# EasyEDA Pro project ProPrj_信达杯电感_2025-12-12.epro

# Schematic Schematic1
Board Name: Board1; Create Date: 2025-11-11; Page Name: P1; Project Name: 信达杯电感; Schematic Name: Schematic1; Update Date: 2025-11-13; Company: 嘉立创EDA; Page Size: A4; Version: V1.0
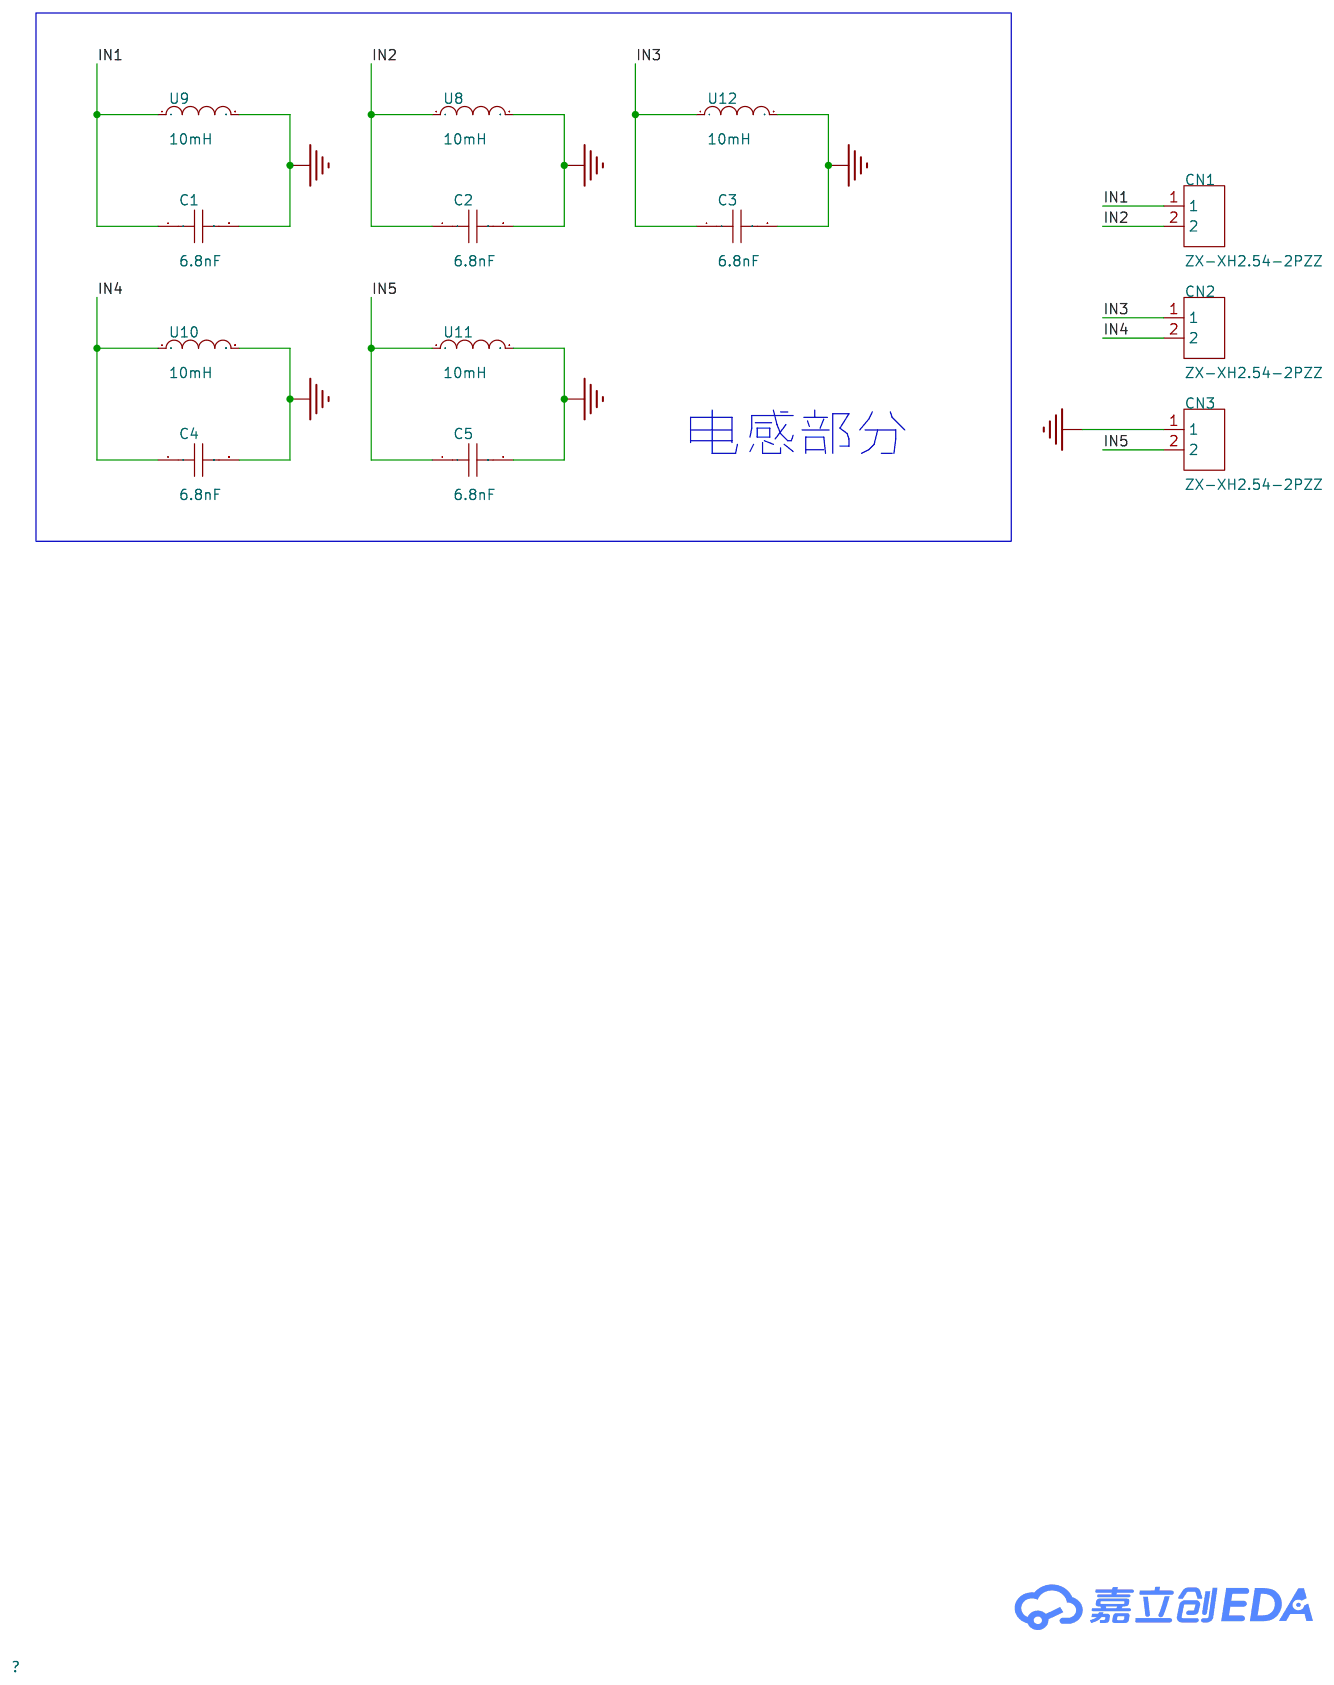
[diagram p0: schematic sheet]

## Parts
C1  6.8nF  [CAP-TH_L7.2-W2.5-P5.00-D0.5]
C2  6.8nF  [CAP-TH_L7.2-W2.5-P5.00-D0.5]
C3  6.8nF  [CAP-TH_L7.2-W2.5-P5.00-D0.5]
C4  6.8nF  [CAP-TH_L7.2-W2.5-P5.00-D0.5]
C5  6.8nF  [CAP-TH_L7.2-W2.5-P5.00-D0.5]
CN1  ZX-XH2.54-2PZZ  [CONN-TH_2P-P2.50_HX25003-2A]
CN2  ZX-XH2.54-2PZZ  [CONN-TH_2P-P2.50_HX25003-2A]
CN3  ZX-XH2.54-2PZZ  [CONN-TH_2P-P2.50_HX25003-2A]
U8  10mH  [IND-TH_BD7.5-P3.00-D0.6]
U9  10mH  [IND-TH_BD7.5-P3.00-D0.6]
U10  10mH  [IND-TH_BD7.5-P3.00-D0.6]
U11  10mH  [IND-TH_BD7.5-P3.00-D0.6]
U12  10mH  [IND-TH_BD7.5-P3.00-D0.6]

## Library data of the parts
C1-C5 = PE104J2A0501: 容值:100nF;精度:±5%;额定电压:100V;介电材料:金属化聚酯;工作温度:-40℃~+85℃;; LCSC Part Name: 100nF ±5% 100V; Supplier Part: C390170; Manufacturer: KYET(科雅); Supplier Footprint: 插件,P=5mm; JLCPCB Part Class: 扩展库; Datasheet: https://item.szlcsc.com/datasheet/PE104J2A0501/366203.html; Supplier: LCSC; Tolerance: ±5%; Voltage Rating: 100V; Dielectric Material: 金属化聚酯; Operating Temperature: -40℃~+85℃
CN1-CN3 = ZX-XH2.54-2PZZ: 插针结构:1x2P;间距:2.54mm;安装方式:直插;参考系列:XH;总PIN数:2P;排数:1;每排PIN数:2;行距:-;额定电流:3A;触头材质:黄铜;触头镀层:锡;工作温度范围:-25℃~+85℃;; Supplier Part: C7429632; Manufacturer: Megastar(兆星); Supplier Footprint: 插件,P=2.54mm; JLCPCB Part Class: 扩展库; Datasheet: https://atta.szlcsc.com/upload/public/pdf/source/20230619/19BA6947230AA44A04D3EDD65E618FD0.pdf; Supplier: LCSC; Pins Structure: 1x2P; Pitch: 2.54mm; Mounting Style: 直插; Reference Series: XH; Number of Pins: 2P; Number of Rows: 1; Number of PINs Per Row: 2; Current Rating (Max): 3A; Contact Material: 黄铜; Contact Plating: 锡; Operating Temperature Range: -25℃~+85℃
U8-U12 = XR6*8-122K-L: 电感值:1.2mH;精度:±10%;类型:工字电感;; Supplier Part: C5380231; Manufacturer: XR(祥如); Supplier Footprint: 插件,D6xL8mm; JLCPCB Part Class: 扩展库; Datasheet: https://atta.szlcsc.com/upload/public/pdf/source/20230605/8CE12735EDCB91383FD21B41176BD527.pdf; Supplier: LCSC; Tolerance: ±10%; Type: 工字电感

## Nets
GND: C1.2 C2.2 C3.2 C4.2 C5.2 CN3.1 U8.2 U9.2 U10.2 U11.2 U12.2
IN1: C1.1 CN1.1 U9.1
IN2: C2.1 CN1.2 U8.1
IN3: C3.1 CN2.1 U12.1
IN4: C4.1 CN2.2 U10.1
IN5: C5.1 CN3.2 U11.1

## Notes on the sheet
- 电感部分

# Schematic Schematic2
Board Name: Board2; Create Date: 2025-11-11; Page Name: P1; Project Name: 信达杯电感; Schematic Name: Schematic2; Update Date: 2025-11-13; Company: 嘉立创EDA; Page Size: A4; Version: V1.0
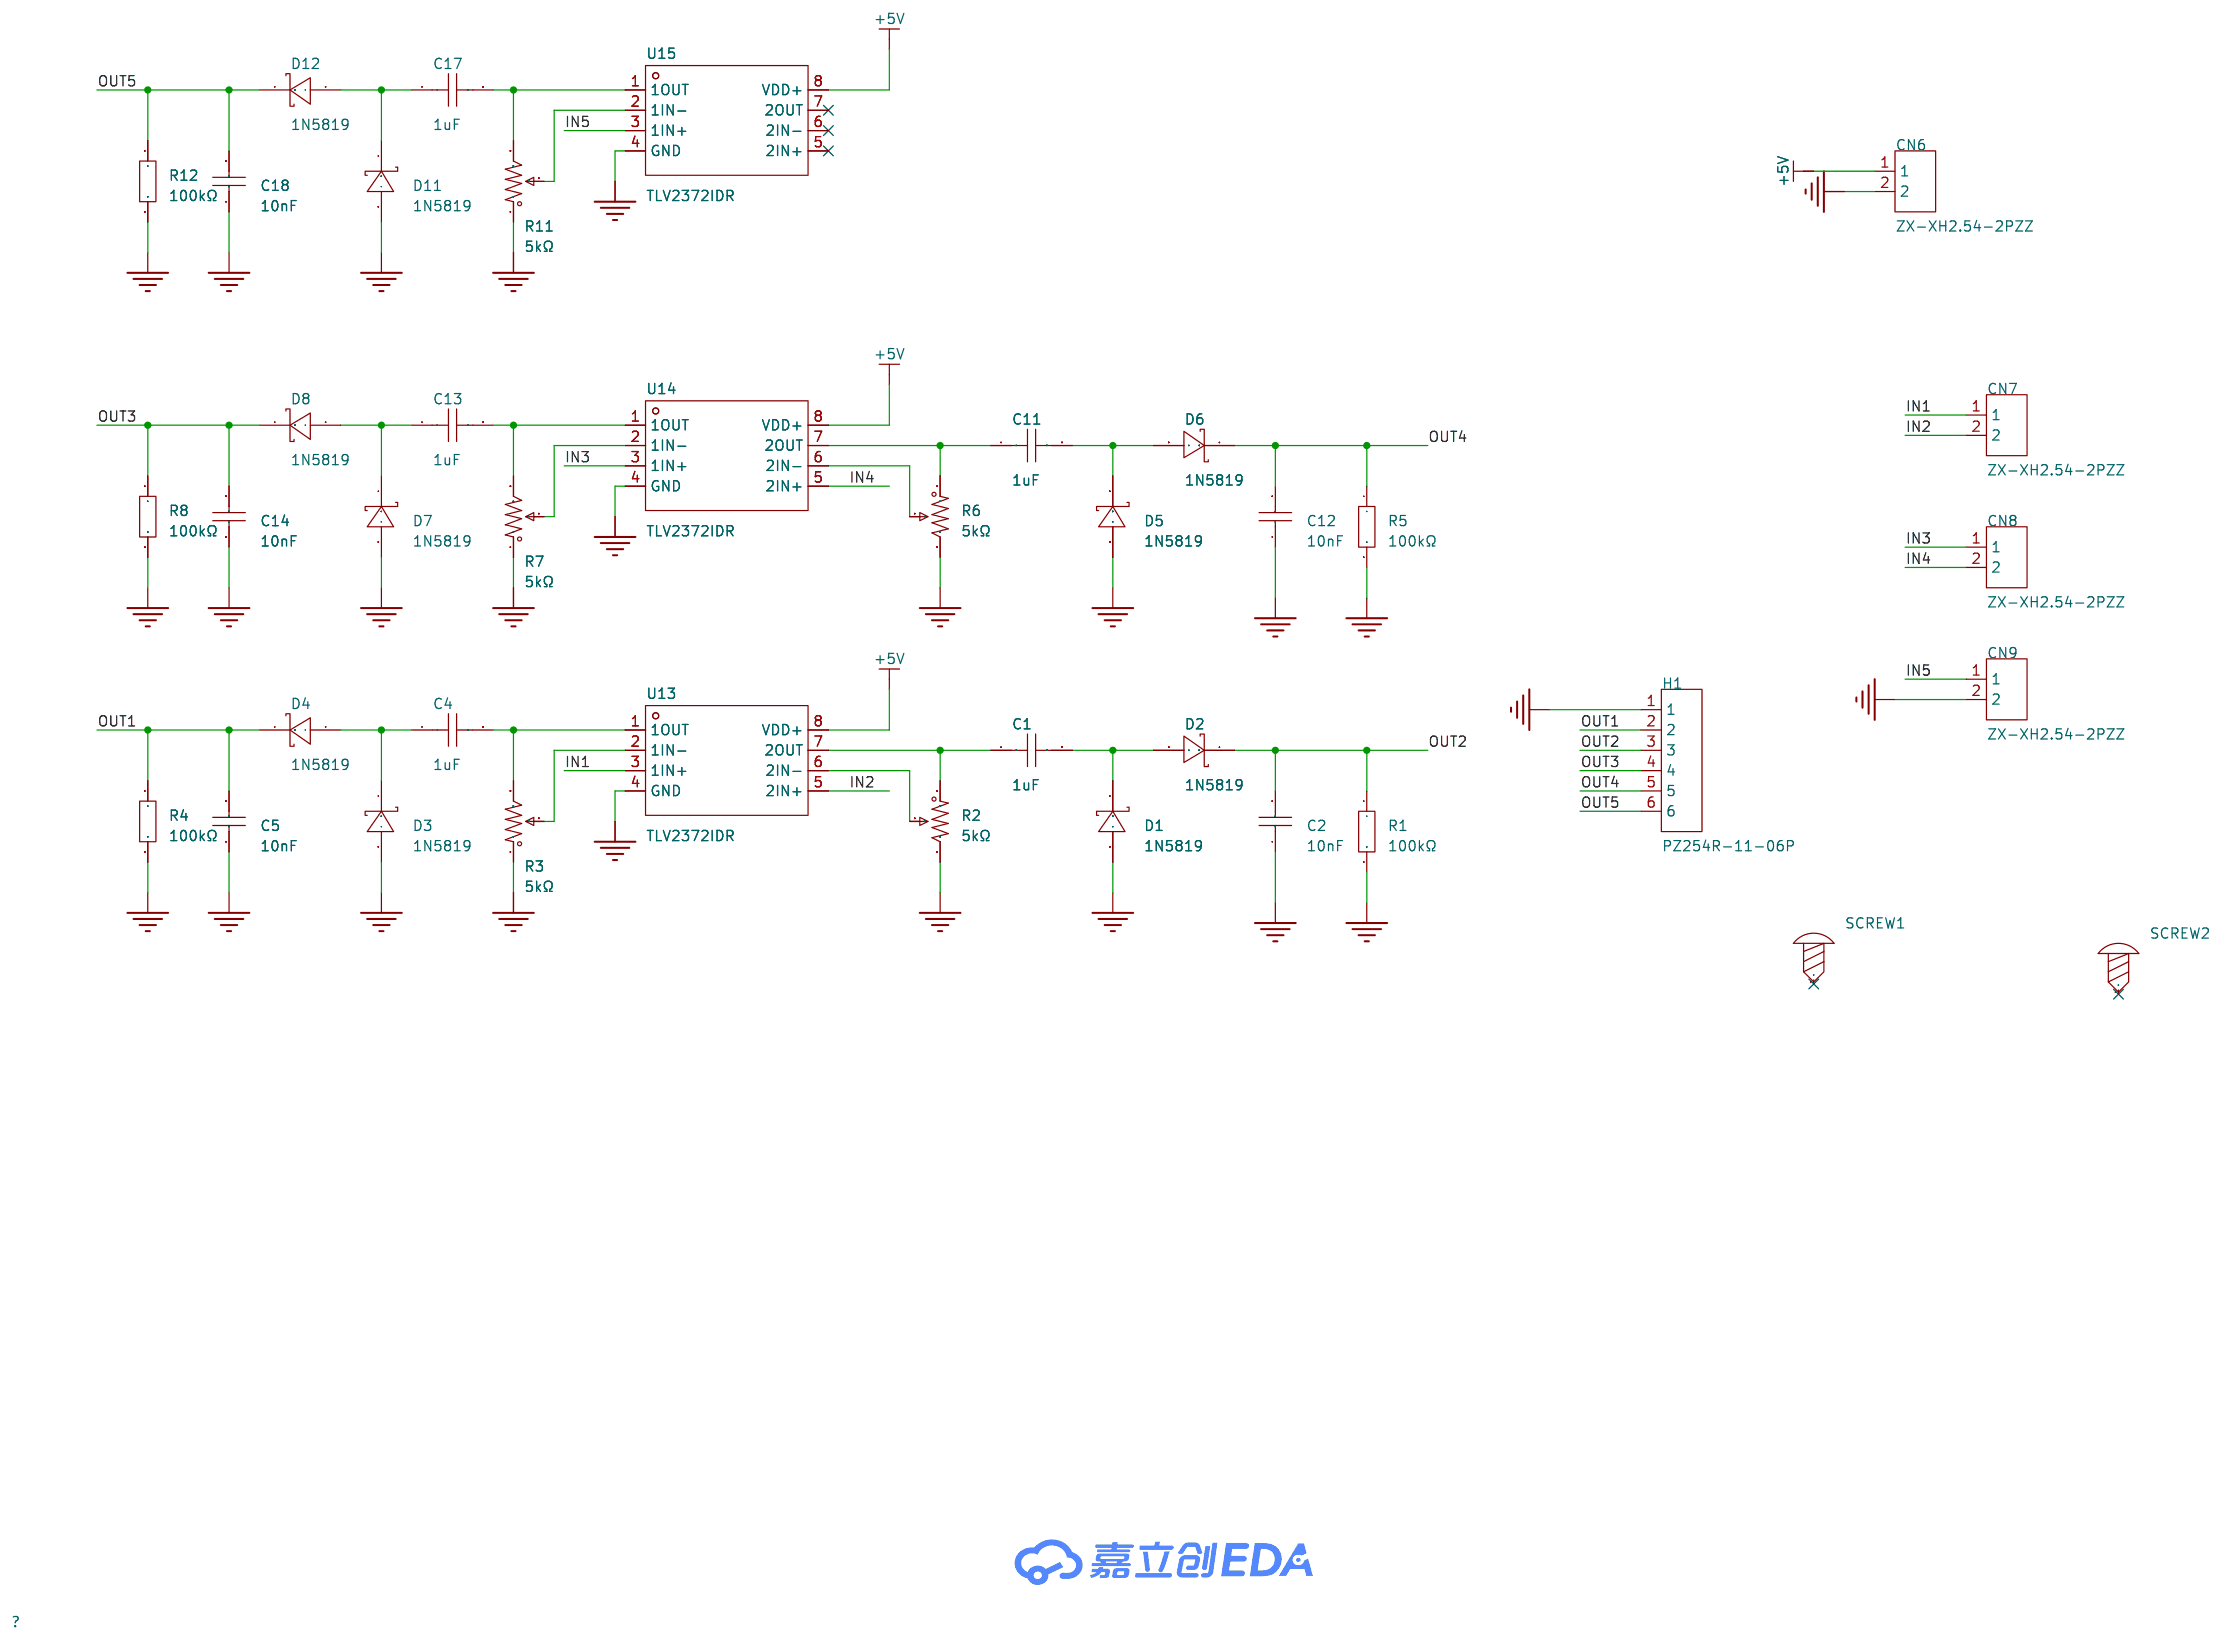
[diagram p1: schematic sheet]

## Parts
C1  1uF  [C0603]
C2  10nF  [C0603]
C4  1uF  [C0603]
C5  10nF  [C0603]
C11  1uF  [C0603]
C12  10nF  [C0603]
C13  1uF  [C0603]
C14  10nF  [C0603]
C17  1uF  [C0603]
C18  10nF  [C0603]
CN6  ZX-XH2.54-2PZZ  [CONN-TH_2P-P2.50_HX25003-2A]
CN7  ZX-XH2.54-2PZZ  [CONN-TH_2P-P2.50_HX25003-2A]
CN8  ZX-XH2.54-2PZZ  [CONN-TH_2P-P2.50_HX25003-2A]
CN9  ZX-XH2.54-2PZZ  [CONN-TH_2P-P2.50_HX25003-2A]
D1  1N5819  [SMA_L4.4-W2.6-LS5.0-RD]
D2  1N5819  [SMA_L4.4-W2.6-LS5.0-RD]
D3  1N5819  [SMA_L4.4-W2.6-LS5.0-RD]
D4  1N5819  [SMA_L4.4-W2.6-LS5.0-RD]
D5  1N5819  [SMA_L4.4-W2.6-LS5.0-RD]
D6  1N5819  [SMA_L4.4-W2.6-LS5.0-RD]
D7  1N5819  [SMA_L4.4-W2.6-LS5.0-RD]
D8  1N5819  [SMA_L4.4-W2.6-LS5.0-RD]
D11  1N5819  [SMA_L4.4-W2.6-LS5.0-RD]
D12  1N5819  [SMA_L4.4-W2.6-LS5.0-RD]
H1  PZ254R-11-06P  [HDR-TH_6P-P2.54-H-M-W10.4]
R1  100kΩ  [R0603]
R2  5kΩ  [RES-ADJ-TH_3P-L9.5-W4.85-P2.50-BL-BS]
R3  5kΩ  [RES-ADJ-TH_3P-L9.5-W4.85-P2.50-BL-BS]
R4  100kΩ  [R0603]
R5  100kΩ  [R0603]
R6  5kΩ  [RES-ADJ-TH_3P-L9.5-W4.85-P2.50-BL-BS]
R7  5kΩ  [RES-ADJ-TH_3P-L9.5-W4.85-P2.50-BL-BS]
R8  100kΩ  [R0603]
R11  5kΩ  [RES-ADJ-TH_3P-L9.5-W4.85-P2.50-BL-BS]
R12  100kΩ  [R0603]
SCREW1  -  [M2螺丝]
SCREW2  -  [M2螺丝]
U13  TLV2372IDR  [SOIC-8_L4.9-W3.9-P1.27-LS6.0-BL]
U14  TLV2372IDR  [SOIC-8_L4.9-W3.9-P1.27-LS6.0-BL]
U15  TLV2372IDR  [SOIC-8_L4.9-W3.9-P1.27-LS6.0-BL]

## Library data of the parts
C1 C4 C11 C13 C17 = CGA0603X5R105K160JT: 容值:1uF;精度:±10%;额定电压:16V;材质(温度系数):X5R;; LCSC Part Name: 1uF ±10% 16V; Supplier Part: C6119849; Manufacturer: HRE(芯声); Supplier Footprint: 0603; JLCPCB Part Class: 扩展库; Supplier: LCSC; Tolerance: ±10%; Voltage Rated: 16V; Temperature Coefficient: X5R
C2 C5 C12 C14 C18 = CC0603KRX7R9BB103: 容值:10nF;精度:±10%;额定电压:50V;材质(温度系数):X7R;; LCSC Part Name: 10nF ±10% 50V; Supplier Part: C100042; Manufacturer: YAGEO(国巨); Supplier Footprint: 0603; JLCPCB Part Class: 扩展库; Datasheet: https://atta.szlcsc.com/upload/public/pdf/source/20181008/C309510_22F155564471FAF6A489F7D68F34234E.pdf; Supplier: LCSC; Tolerance: ±10%; Voltage Rated: 50V; Temperature Coefficient: X7R
CN6-CN9 = ZX-XH2.54-2PZZ: 插针结构:1x2P;间距:2.54mm;安装方式:直插;参考系列:XH;总PIN数:2P;排数:1;每排PIN数:2;行距:-;额定电流:3A;触头材质:黄铜;触头镀层:锡;工作温度范围:-25℃~+85℃;; Supplier Part: C7429632; Manufacturer: Megastar(兆星); Supplier Footprint: 插件,P=2.54mm; JLCPCB Part Class: 扩展库; Datasheet: https://atta.szlcsc.com/upload/public/pdf/source/20230619/19BA6947230AA44A04D3EDD65E618FD0.pdf; Supplier: LCSC; Pins Structure: 1x2P; Pitch: 2.54mm; Mounting Style: 直插; Reference Series: XH; Number of Pins: 2P; Number of Rows: 1; Number of PINs Per Row: 2; Current Rating (Max): 3A; Contact Material: 黄铜; Contact Plating: 锡; Operating Temperature Range: -25℃~+85℃
D1-D8 D11 D12 = 1N5819_C437199: 正向压降(Vf):500mV@1A;直流反向耐压(Vr):40V;平均整流电流(Io):1A;; LCSC Part Name: 电压:40V 电流:1A; Supplier Part: C437199; Manufacturer: KEXIN(科信); Supplier Footprint: DO-214AC(SMA); JLCPCB Part Class: 扩展库; Datasheet: https://atta.szlcsc.com/upload/public/pdf/source/20191012/C437199_83583E622A6684E767605E43C169C596.pdf; Supplier: LCSC; Forward Voltage (Vf@If): 500mV@1A; Reverse Voltage (Vr): 40V; Average Rectified Current (Io): 1A
H1 = PZ254R-11-06P: 插针结构:1x6P;间距:2.54mm;行距:-;圆针/方针:方针;安装方式:弯插;排数:单排;总PIN位数:6P;额定电流:-;额定电压:-;配合针长度:6mm;塑高:2.5mm;触头材质:黄铜;触头镀层:-;工作温度:-40℃~+105℃;颜色:黑色;; LCSC Part Name: 1x6P 间距:2.54mm 方针 弯插; Supplier Part: C492414; Manufacturer: XFCN(兴飞); Supplier Footprint: 弯插,P=2.54mm; JLCPCB Part Class: 扩展库; Datasheet: https://atta.szlcsc.com/upload/public/pdf/source/20200309/C492414_188252315A8FC19F8382BF484DD4F4B8.pdf; Supplier: LCSC; Pin Structure: 1x6P; Pitch: 2.54mm; Circluar Pins/Square Pins: 方针; Mounting Type: 弯插; Number of Rows: 单排; Number of Pins: 6P; Length of Mating Pin: 6mm; Insulation Height: 2.5mm; Contact Material: 黄铜; Operating Temperature: -40℃~+105℃; Color: 黑色
R1 R4 R5 R8 R12 = 0603WAF1003T5E: 电阻类型:厚膜电阻;阻值:100kΩ;精度:±1%;功率:100mW;最大工作电压:75V;温度系数:±100ppm/℃;; LCSC Part Name: 100kΩ ±1% 100mW 厚膜电阻; Supplier Part: C25803; Manufacturer: UNI-ROYAL(厚声); Supplier Footprint: 0603; JLCPCB Part Class: 基础库; Datasheet: https://atta.szlcsc.com/upload/public/pdf/source/20200306/C422600_1E6D84923E4A46A82E41ADD87F860B5C.pdf; Supplier: LCSC; Type: 厚膜电阻; Tolerance: ±1%; Power(Watts): 100mW; Overload Voltage (Max): 75V; Temperature Coefficient: ±100ppm/℃; Operating Temperature Range: -55℃~+155℃
R2 R3 R6 R7 R11 = 3296W-1-502: 阻值:5kΩ;精度:±10%;; LCSC Part Name: 5kΩ ±10%; Supplier Part: C118907; Manufacturer: BOCHEN(博晨); Supplier Footprint: 插件; JLCPCB Part Class: 扩展库; Datasheet: https://atta.szlcsc.com/upload/public/pdf/source/20171114/C118907_15106326547951117397.pdf; Supplier: LCSC; Tolerance: ±10%
SCREW1 SCREW2 = M2螺丝: Supplier Footprint: 插件
U13-U15 = TLV2372IDR: 放大器数:双路;增益带宽积(GBP):3MHz;输入偏置电流(Ib):1pA;压摆率(SR):2.1V/us;带宽(-3db):-;轨到轨:-;; Supplier Part: C27204; Manufacturer: TI(德州仪器); Supplier Footprint: SOIC-8; JLCPCB Part Class: 扩展库; Datasheet: https://www.ti.com/cn/lit/gpn/tlv2372; Supplier: LCSC; Number of Circuits: 双路; Gain Bandwidth Product(GBP): 3MHz; Current - Input Bias(Ib): 1pA; Slew Rate(SR): 2.1V/us; Output Current: 16mA; Operating Temperature: -40℃~+125℃

## Nets
+5V: CN6.1 U13.8(VDD+) U14.8(VDD+) U15.8(VDD+)
GND: C2.1 C5.1 C12.1 C14.1 C18.1 CN6.2 CN9.2 D1.2(A) D3.2(A) D5.2(A) D7.2(A) D11.2(A) H1.1 R1.2 R2.3 R3.1 R4.2 R5.2 R6.3 R7.1 R8.2 R11.1 R12.2 U13.4(GND) U14.4(GND) U15.4(GND)
IN1: CN7.1 U13.3(1IN+)
IN2: CN7.2 U13.5(2IN+)
IN3: CN8.1 U14.3(1IN+)
IN4: CN8.2 U14.5(2IN+)
IN5: CN9.1 U15.3(1IN+)
OUT1: C5.2 D4.1(C) H1.2 R4.1
OUT2: C2.2 D2.1(C) H1.3 R1.1
OUT3: C14.2 D8.1(C) H1.4 R8.1
OUT4: C12.2 D6.1(C) H1.5 R5.1
OUT5: C18.2 D12.1(C) H1.6 R12.1
$1N1503: C1.2 D1.1(C) D2.2(A)
$1N1506: R7.2 U14.2(1IN-)
$1N1509: C13.2 R7.3 U14.1(1OUT)
$1N1520: C13.1 D7.1(C) D8.2(A)
$1N1526: C11.2 D5.1(C) D6.2(A)
$1N1528: C11.1 R6.1 U14.7(2OUT)
$1N1530: R6.2 U14.6(2IN-)
$1N1535: C4.2 R3.3 U13.1(1OUT)
$1N1536: C1.1 R2.1 U13.7(2OUT)
$1N1537: R2.2 U13.6(2IN-)
$1N1541: R3.2 U13.2(1IN-)
$1N1544: R11.2 U15.2(1IN-)
$1N1548: C17.2 R11.3 U15.1(1OUT)
$1N1551: C17.1 D11.1(C) D12.2(A)
$1N1568: C4.1 D3.1(C) D4.2(A)

Not connected (* = marked no-connect by the designer): SCREW1 1*; SCREW2 1*; U15 5(2IN+)* 6(2IN-)* 7(2OUT)*

# Board PCB1
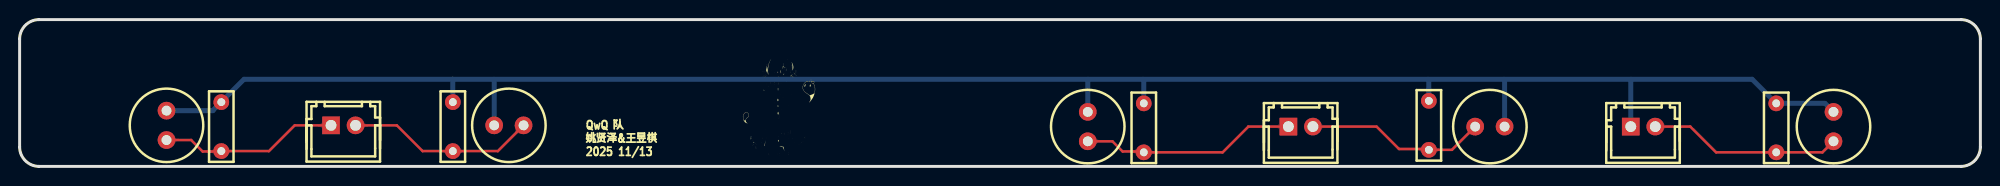
[diagram p2: board, top side]
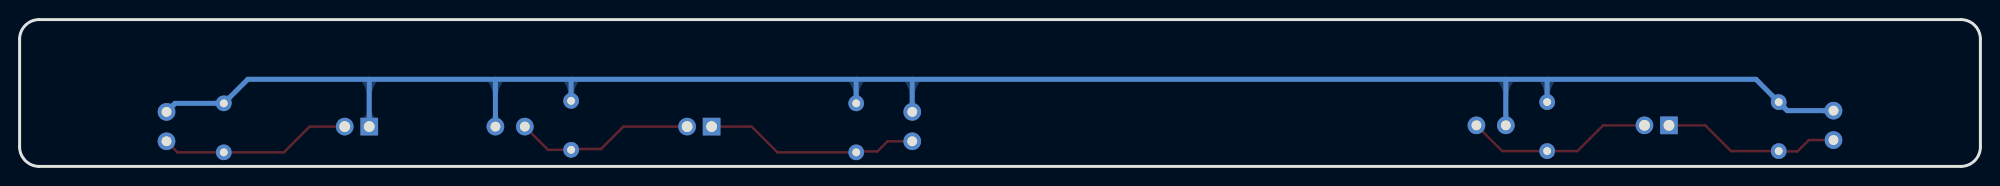
[diagram p3: board, bottom side, seen from below]

Outline 200.03 x 14.99 mm; copper layers: Top Layer, Bottom Layer. Coordinates in mm from the lower left corner of the outline.
Outline path: 0,12.99 0,2 arc(0.59,0.59) 2,0 198.03,0 arc(199.44,0.59) 200.03,2 200.03,12.99 arc(199.44,14.4) 198.03,14.99 2,14.99 arc(0.59,14.4) 0,12.99
Stack: Top Layer 0.035mm / Dielectric1 1.51mm FR4 er 4.5 / Bottom Layer 0.035mm

## Design rules (mm)
template: 自定义配置
spacing copperThickness1oz (default): track to track 0.102, other pairs 0.152 to 0.3
spacing copperThickness2oz: track to track 0.203, other pairs 0.152 to 0.3
track width copperThickness1oz (default): min 0.127, default 0.254, max 2.54
track width copperThickness2oz: min 0.203, default 0.254, max 2.54
differential pair differentialPair (default): width min 0.127, default 0.254, max 2.54; gap min 0.152, default 0.152
via viaSize (default): diameter min 0.5, default 0.61, max 10; hole min 0.3, default 0.305, max 6.3

## Placement (name value [footprint] x y rotation side)
C1  6.8nF  [CAP-TH_L7.2-W2.5-P5.00-D0.5]  20.57 4.06 90 top
C2  6.8nF  [CAP-TH_L7.2-W2.5-P5.00-D0.5]  44.2 4.06 90 top
C3  6.8nF  [CAP-TH_L7.2-W2.5-P5.00-D0.5]  114.68 3.94 90 top
C4  6.8nF  [CAP-TH_L7.2-W2.5-P5.00-D0.5]  143.76 4.19 90 top
C5  6.8nF  [CAP-TH_L7.2-W2.5-P5.00-D0.5]  179.2 3.94 90 top
CN1  ZX-XH2.54-2PZZ  [CONN-TH_2P-P2.50_HX25003-2A]  33.02 4.19 0 top
CN2  ZX-XH2.54-2PZZ  [CONN-TH_2P-P2.50_HX25003-2A]  130.68 4.06 0 top
CN3  ZX-XH2.54-2PZZ  [CONN-TH_2P-P2.50_HX25003-2A]  165.61 4.06 0 top
U8  10mH  [IND-TH_BD7.5-P3.00-D0.6]  49.91 4.19 180 top
U9  10mH  [IND-TH_BD7.5-P3.00-D0.6]  14.99 4.19 90 top
U10  10mH  [IND-TH_BD7.5-P3.00-D0.6]  149.99 4.06 0 top
U11  10mH  [IND-TH_BD7.5-P3.00-D0.6]  185.04 4.06 90 top
U12  10mH  [IND-TH_BD7.5-P3.00-D0.6]  108.97 4.06 90 top

## Footprints (pads in the part's own frame, mm; a bottom-side part is the same pattern mirrored in y, then rotated)
CAP-TH_L7.2-W2.5-P5.00-D0.5
  round 1.6 hole 0.8: 1(-2.5,0) 2(2.5,0)
CONN-TH_2P-P2.50_HX25003-2A
  rect 1.8x1.8 hole 1.1: 1(-1.25,0)
  round 1.8 hole 1.1: 2(1.25,0)
IND-TH_BD7.5-P3.00-D0.6
  round 1.8 hole 1: 1(-1.5,0) 2(1.5,0)

## Nets
As in the schematic.

## Routing (per net, layer and track width the routed paths; a pad name or vN(x,y) marks a point on that pad's centre or on a via; arc(x,y) is an arc through that point)
GND: length 197.5
  Bottom Layer w0.508: 114.63,8.89 143.71,8.89 ; 114.63,8.89 114.68,8.84 C3.2 ; 114.63,8.89 108.96,8.89 ; 143.71,8.89 143.76,8.83 C4.2 ; 143.71,8.89 151.45,8.89 ; 44.19,8.89 48.39,8.89 ; 44.19,8.89 44.2,8.89 C2.2 ; 44.19,8.89 22.9,8.89 C1.2 19.7,5.69 U9.2 ; 48.39,8.89 48.41,8.87 U8.2 ; 48.39,8.89 108.96,8.89 ; U10.2 151.49,8.85 151.45,8.89 ; 164.34,8.89 176.74,8.89 C5.2 184.17,6.44 U11.2 ; 164.34,8.89 164.36,8.87 CN3.1 ; 164.34,8.89 151.45,8.89 ; 108.96,8.89 108.97,8.88 U12.2
IN1: length 18.4
  Top Layer w0.254: U9.1 17.5,2.69 18.67,1.52 20.53,1.52 C1.1 25.44,1.56 28.07,4.19 CN1.1
IN2: length 19.3
  Top Layer w0.254: U8.1 48.78,1.56 C2.1 41.11,1.56 38.48,4.19 CN1.2
IN3: length 22
  Top Layer w0.254: U12.1 111.48,2.56 112.52,1.52 114.59,1.52 C3.1 122.72,1.44 125.35,4.06 CN2.1
IN4: length 18.5
  Top Layer w0.254: CN2.2 138.43,4.06 140.72,1.78 143.68,1.78 C4.1 146.11,1.69 U10.1
IN5: length 19.7
  Top Layer w0.254: U11.1 183.91,1.44 C5.1 173.06,1.44 170.43,4.06 CN3.2

Small or netless copper shapes (teardrops, artwork), in the pictures only: 20 on Top Layer, 20 on Bottom Layer

## Text on the board
Top Silkscreen Layer: QwQ 队 / 姚贤泽&王昱棋 / 2025 11/13

# Board PCB5
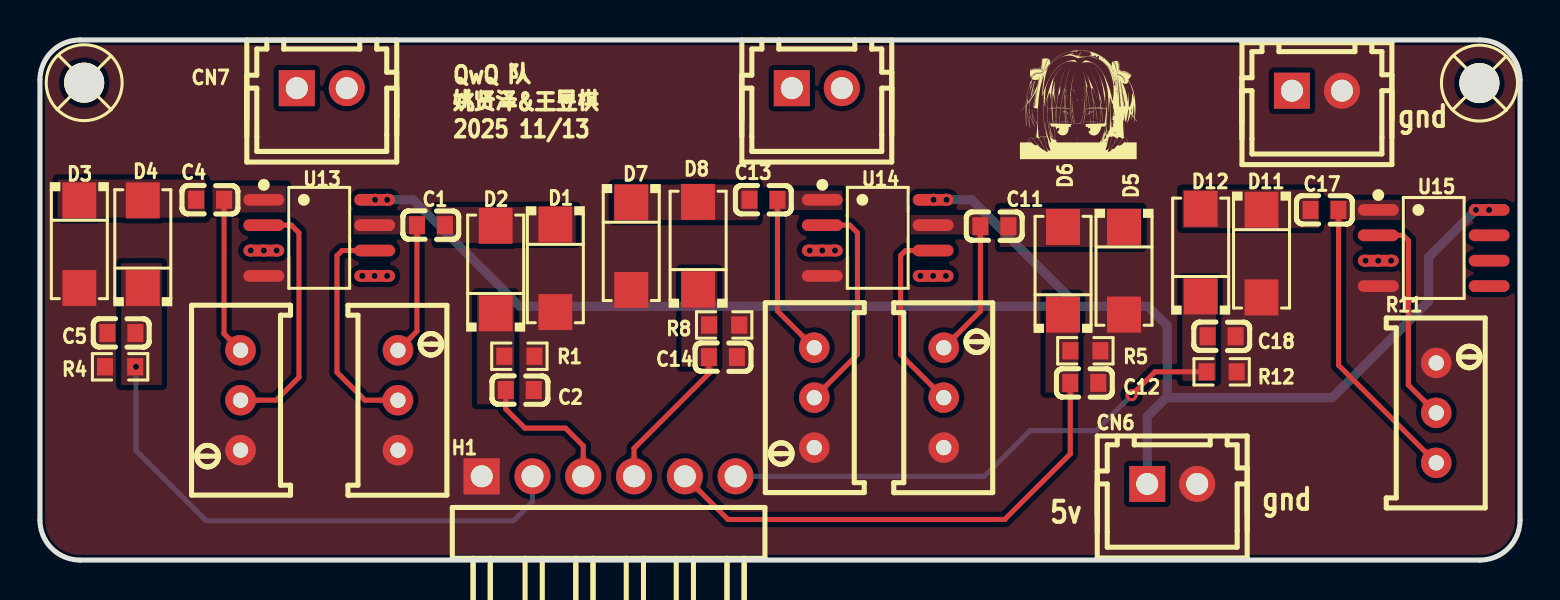
[diagram p4: board, top side]
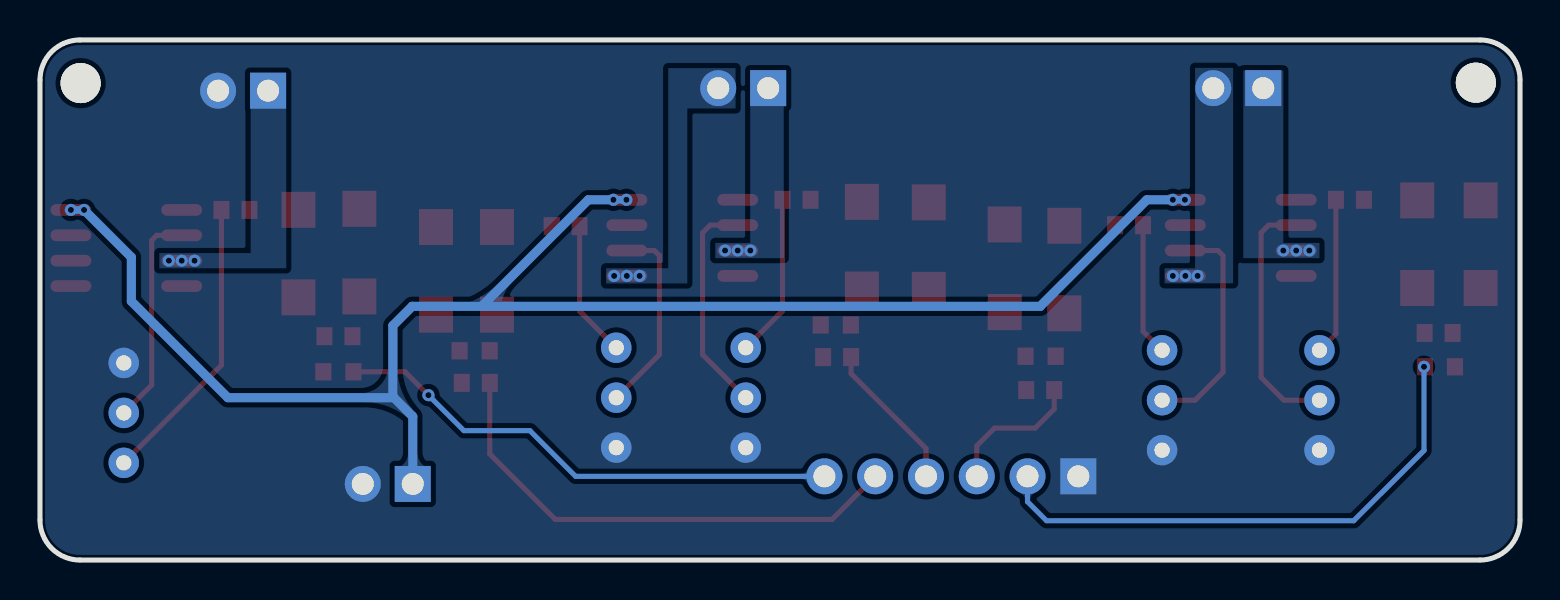
[diagram p5: board, bottom side, seen from below]

Outline 74.04 x 26.03 mm; copper layers: Top Layer, Bottom Layer. Coordinates in mm from the lower left corner of the outline.
Outline path: 0,24.03 0,2 arc(0.59,0.59) 2,0 72.04,0 arc(73.46,0.59) 74.04,2 74.04,24.03 arc(73.46,25.45) 72.04,26.03 2,26.03 arc(0.59,25.45) 0,24.03
Stack: Top Layer 0.035mm / Dielectric1 1.51mm FR4 er 4.5 / Bottom Layer 0.035mm

## Design rules (mm)
template: 自定义配置
spacing copperThickness1oz (default): track to track 0.102, other pairs 0.152 to 0.3
spacing copperThickness2oz: track to track 0.203, other pairs 0.152 to 0.3
track width copperThickness1oz (default): min 0.127, default 0.254, max 2.54
track width copperThickness2oz: min 0.203, default 0.254, max 2.54
differential pair differentialPair (default): width min 0.127, default 0.254, max 2.54; gap min 0.152, default 0.152
via viaSize (default): diameter min 0.5, default 0.61, max 10; hole min 0.3, default 0.305, max 6.3

## Placement (name value [footprint] x y rotation side)
C1  1uF  [C0603]  19.56 16.76 0 top
C2  10nF  [C0603]  24 8.51 180 top
C4  1uF  [C0603]  8.51 18.03 0 top
C5  10nF  [C0603]  4.07 11.37 0 top
C11  1uF  [C0603]  47.75 16.71 0 top
C12  10nF  [C0603]  52.24 8.87 180 top
C13  1uF  [C0603]  36.19 18.03 0 top
C14  10nF  [C0603]  34.16 10.16 180 top
C17  1uF  [C0603]  64.26 17.53 0 top
C18  10nF  [C0603]  59.11 11.2 180 top
CN6  ZX-XH2.54-2PZZ  [CONN-TH_2P-P2.50_HX25003-2A]  56.64 3.81 0 top
CN7  ZX-XH2.54-2PZZ  [CONN-TH_2P-P2.50_HX25003-2A]  14.1 23.62 0 top
CN8  ZX-XH2.54-2PZZ  [CONN-TH_2P-P2.50_HX25003-2A]  38.86 23.62 0 top
CN9  ZX-XH2.54-2PZZ  [CONN-TH_2P-P2.50_HX25003-2A]  63.88 23.49 0 top
D1  1N5819  [SMA_L4.4-W2.6-LS5.0-RD]  25.78 14.6 270 top
D2  1N5819  [SMA_L4.4-W2.6-LS5.0-RD]  22.8 14.54 90 top
D3  1N5819  [SMA_L4.4-W2.6-LS5.0-RD]  1.97 15.81 270 top
D4  1N5819  [SMA_L4.4-W2.6-LS5.0-RD]  5.14 15.81 90 top
D5  1N5819  [SMA_L4.4-W2.6-LS5.0-RD]  54.23 14.48 270 top
D6  1N5819  [SMA_L4.4-W2.6-LS5.0-RD]  51.18 14.48 90 top
D7  1N5819  [SMA_L4.4-W2.6-LS5.0-RD]  29.58 15.72 270 top
D8  1N5819  [SMA_L4.4-W2.6-LS5.0-RD]  32.93 15.74 90 top
D11  1N5819  [SMA_L4.4-W2.6-LS5.0-RD]  61.11 15.34 270 top
D12  1N5819  [SMA_L4.4-W2.6-LS5.0-RD]  58.06 15.39 90 top
H1  PZ254R-11-06P  [HDR-TH_6P-P2.54-H-M-W10.4]  28.45 4.19 0 top
R1  100kΩ  [R0603]  23.98 10.2 0 top
R2  5kΩ  [RES-ADJ-TH_3P-L9.5-W4.85-P2.50-BL-BS]  17.91 8 0 top
R3  5kΩ  [RES-ADJ-TH_3P-L9.5-W4.85-P2.50-BL-BS]  10.03 8 180 top
R4  100kΩ  [R0603]  4.01 9.67 180 top
R5  100kΩ  [R0603]  52.3 10.48 0 top
R6  5kΩ  [RES-ADJ-TH_3P-L9.5-W4.85-P2.50-BL-BS]  45.21 8.13 0 top
R7  5kΩ  [RES-ADJ-TH_3P-L9.5-W4.85-P2.50-BL-BS]  38.74 8.13 180 top
R8  100kΩ  [R0603]  34.23 11.77 0 top
R11  5kΩ  [RES-ADJ-TH_3P-L9.5-W4.85-P2.50-BL-BS]  69.85 7.37 0 top
R12  100kΩ  [R0603]  59.11 9.42 0 top
SCREW1  -  [M2螺丝]  2.21 23.9 0 top
SCREW2  -  [M2螺丝]  72.01 23.88 0 top
U13  TLV2372IDR  [SOIC-8_L4.9-W3.9-P1.27-LS6.0-BL]  13.97 16.13 270 top
U14  TLV2372IDR  [SOIC-8_L4.9-W3.9-P1.27-LS6.0-BL]  41.91 16.13 270 top
U15  TLV2372IDR  [SOIC-8_L4.9-W3.9-P1.27-LS6.0-BL]  69.72 15.62 270 top

## Footprints (pads in the part's own frame, mm; a bottom-side part is the same pattern mirrored in y, then rotated)
C0603
  rect 0.8x0.9 smd: 1(-0.7,0) 2(0.7,0)
CONN-TH_2P-P2.50_HX25003-2A
  rect 1.8x1.8 hole 1.1: 1(-1.25,0)
  round 1.8 hole 1.1: 2(1.25,0)
HDR-TH_6P-P2.54-H-M-W10.4
  rect 1.8x1.8 hole 1.1: 1(-6.35,0)
  round 1.8 hole 1.1: 2(-3.81,0) 3(-1.27,0) 4(1.27,0) 5(3.81,0) 6(6.35,0)
M2螺丝
  round 2 hole 2: 1(0,0)
R0603
  rect 0.806x0.864 smd: 1(-0.753,0) 2(0.753,0)
RES-ADJ-TH_3P-L9.5-W4.85-P2.50-BL-BS
  round 1.524 hole 0.762: 1(0,2.5) 2(0,0) 3(0,-2.5)
SMA_L4.4-W2.6-LS5.0-RD
  rect 1.8x1.7 smd: 1(-2.192,0) 2(2.192,0)
SOIC-8_L4.9-W3.9-P1.27-LS6.0-BL
  oval 0.588x2.045 smd: 1(-1.905,-2.772) 2(-0.635,-2.772) 3(0.635,-2.772) 4(1.905,-2.772) 5(1.905,2.772) 6(0.635,2.772) 7(-0.635,2.772) 8(-1.905,2.772)

## Nets
As in the schematic.

Pads without a net: SCREW1 1; SCREW2 1; U15 5 6 7

## Via types
v1: diameter 0.61, hole 0.305, Top Layer to Bottom Layer, 23 vias

## Routing (per net, layer and track width the routed paths; a pad name or vN(x,y) marks a point on that pad's centre or on a via; arc(x,y) is an arc through that point)
+5V: length 81.4
  Bottom Layer w0.381: v1(17.37,18.03) v1(16.76,18.03) ; v1(45.35,18.03) v1(44.7,18.03) ; v1(72.5,17.53) v1(71.83,17.53)
  Bottom Layer w0.457: 51.94,12.7 46.61,18.03 v1(45.35,18.03) ; 51.94,12.7 24,12.7 18.67,18.03 v1(17.37,18.03) ; 51.94,12.7 55.42,12.7 56.39,11.73 56.39,8.18 56.33,8.13 ; 56.33,8.13 64.64,8.13 69.47,12.95 69.47,15.16 v1(71.83,17.53) ; 56.33,8.13 55.39,7.19 CN6.1
IN1:
  vias: v1(10.54,15.49) v1(11.2,15.49) v1(11.84,15.49)
IN2:
  vias: v1(16.13,14.22) v1(16.74,14.22) v1(17.37,14.22)
IN3:
  vias: v1(38.51,15.49) v1(39.14,15.49) v1(39.77,15.49)
IN4:
  vias: v1(44.04,14.22) v1(44.68,14.22) v1(45.32,14.22)
IN5:
  vias: v1(66.31,14.99) v1(66.95,14.99) v1(67.59,14.99)
OUT1: length 27.1
  Bottom Layer w0.254: v1(4.8,9.67) 4.8,5.48 8.32,1.97 23.69,1.97 24.64,2.92 H1.2
OUT2: length 7.1
  Top Layer w0.254: H1.3 27.18,5.72 26.29,6.6 24.26,6.6 23.3,7.56 C2.2
OUT3: length 7.5
  Top Layer w0.254: C14.2 33.46,9.33 29.72,5.59 H1.4
OUT4: length 25.1
  Top Layer w0.254: C12.2 51.54,5.31 48.26,2.03 34.42,2.03 H1.5
OUT5: length 25.7
  Top Layer w0.254: R12.1 55.78,9.42 v1(54.61,8.25)
  Bottom Layer w0.254: v1(54.61,8.25) 52.83,6.48 49.53,6.48 47.24,4.19 H1.6
$1N1506: length 11.1
  Top Layer w0.254: U14.2 40.51,16.76 40.89,16.38 40.89,10.29 R7.2
$1N1509: length 8.2
  Top Layer w0.254: 36.9,18.03 36.9,12.47 R7.3
$1N1528: length 6.8
  Top Layer w0.254: R6.1 47.05,12.46 47.05,16.71
$1N1530: length 9.7
  Top Layer w0.254: 44.68,15.49 43.31,15.49 43.05,15.24 43.05,10.29 R6.2
$1N1535: length 7.9
  Top Layer w0.254: C4.2 9.21,11.33 R3.3
$1N1536: length 6.7
  Top Layer w0.254: R2.1 18.86,11.45 C1.1
$1N1537: length 11.5
  Top Layer w0.254: 16.74,15.49 15.11,15.49 14.86,15.24 14.86,9.4 16.26,8 R2.2
$1N1541: length 12.5
  Top Layer w0.254: R3.2 11.81,8 12.95,9.14 12.95,16.38 12.57,16.76 U13.2
$1N1544: length 10.8
  Top Layer w0.254: U15.2 68.2,16.26 68.45,16 68.45,8.76 R11.2
$1N1548: length 14.7
  Top Layer w0.254: C17.2 64.96,9.75 R11.3

## Copper pours and planes (outline as drawn; the poured copper is in the pictures)
GND on Top Layer: -1.4,28.45 76.33,28.45 76.33,-1.52 -1.4,-1.52
GND on Bottom Layer: -1.52,28.58 75.82,28.58 75.82,-1.78 -1.52,-1.78
IN1 on Bottom Layer: 10.03,24.51 13.84,24.51 13.84,15.11 10.03,15.11
IN2 on Bottom Layer: 14.35,24.64 17.78,24.64 17.78,13.85 14.35,13.85
IN3 on Bottom Layer: 36.83,24.5 40.26,24.5 40.26,15.11 36.83,15.11
IN4 on Bottom Layer: 39.24,24.63 45.72,24.63 45.72,13.84 39.24,13.84
IN5 on Bottom Layer: 61.72,24.38 68.07,24.38 68.07,14.6 61.72,14.6
OUT1 on Top Layer: 4.06,14.86 6.1,14.86 6.1,8.76 4.06,8.76
OUT2 on Top Layer: 21.86,13.34 23.72,13.34 23.72,7.8 21.86,7.8
OUT3 on Top Layer: 32.08,14.54 33.88,14.54 33.88,9.69 32.08,9.69
OUT4 on Top Layer: 50.31,13.28 51.94,13.28 51.94,8.38 50.31,8.38
OUT5 on Top Layer: 57.15,14.1 58.83,14.1 58.83,8.97 57.15,8.97
$1N1503 on Top Layer: 19.84,17.68 26.8,17.68 26.8,15.88 19.84,15.88
$1N1509 on Top Layer: 36.48,18.49 40.13,18.49 40.13,17.53 36.48,17.53
$1N1520 on Top Layer: 28.7,18.8 35.9,18.8 35.9,17.01 28.7,17.01
$1N1526 on Top Layer: 48.03,17.62 55.11,17.62 55.11,15.67 48.03,15.67
$1N1528 on Top Layer: 43.56,17.27 47.45,17.27 47.45,16.3 43.56,16.3
$1N1535 on Top Layer: 8.63,18.74 12.32,18.74 12.32,17.4 8.63,17.4
$1N1536 on Top Layer: 15.69,17.24 19.26,17.24 19.26,16.3 15.69,16.3
$1N1548 on Top Layer: 64.52,18.03 68.07,18.03 68.07,17.02 64.52,17.02
$1N1551 on Top Layer: 57.15,18.54 63.97,18.54 63.97,16.62 57.15,16.62
$1N1568 on Top Layer: 0.89,19.05 8.25,19.05 8.25,17.14 0.89,17.14

Small or netless copper shapes (teardrops, artwork), in the pictures only: 28 on Top Layer, 16 on Bottom Layer

## Text on the board
Top Silkscreen Layer: 5v | gnd | QwQ 队 / 姚贤泽&王昱棋 / 2025 11/13
